# EAGLE design EurocardBackplane-V2_0-short (EAGLE 6.6.0)

## Sheet 1 of 2
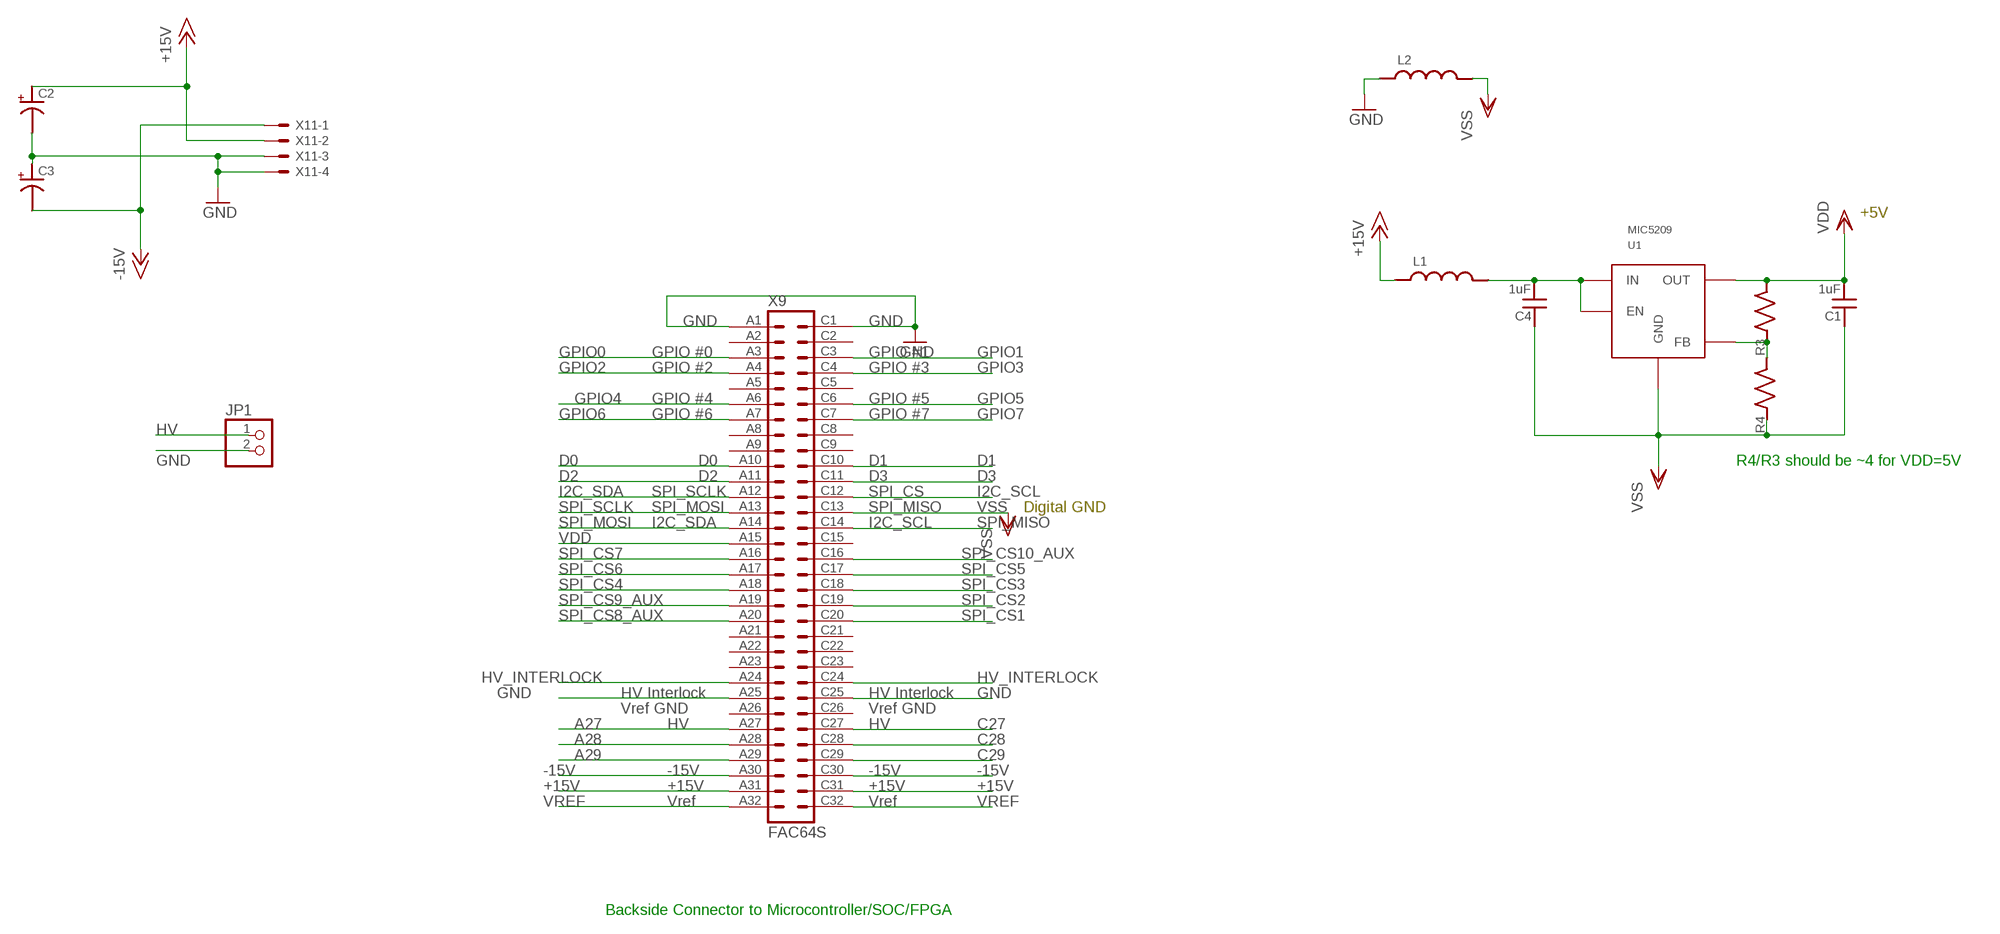
[diagram p0: schematic, sheet 1]

### Parts
C1  1uF  C_MLCC_SMDCMLCC_0603  [C_MLCC_0603]
C2  C_POL_SMDF  [PANASONIC_F]
C3  C_POL_SMDF  [PANASONIC_F]
C4  1uF  C_MLCC_SMDCMLCC_0603  [C_MLCC_0603]
JP1  PINHD-1X2  [1X02]
L1  L_FERRITE_SMDLFERRITE_0805  [R_0805]
L2  L_FERRITE_SMDLFERRITE_0805  [R_0805]
R3  R_SMDR0603  [R_0603]
R4  R_SMDR0603  [R_0603]
U1  MIC5209  [TO263-5]
X9  FAC64S  [FAC64S]
X11  5566-4  [5566-4]

### Nets
+15V: C2.+ L1.P$1 X9.A31 X9.C31 X11.2 ; also sheet 2
-15V: C3.- X9.A30 X9.C30 X11.1 ; also sheet 2
A27: X9.A27 ; also sheet 2
A28: X9.A28 ; also sheet 2
A29: X9.A29 ; also sheet 2
C27: X9.C27 ; also sheet 2
C28: X9.C28 ; also sheet 2
C29: X9.C29 ; also sheet 2
D0: X9.A10 ; also sheet 2
D1: X9.C10 ; also sheet 2
D2: X9.A11 ; also sheet 2
D3: X9.C11 ; also sheet 2
GND: C2.- C3.+ JP1.2 L2.P$1 X9.A1 X9.A25 X9.C1 X9.C25 X11.3 X11.4 ; also sheet 2
GPIO0: X9.A3 ; also sheet 2
GPIO1: X9.C3 ; also sheet 2
GPIO2: X9.A4 ; also sheet 2
GPIO3: X9.C4 ; also sheet 2
GPIO4: X9.A6 ; also sheet 2
GPIO5: X9.C6 ; also sheet 2
GPIO6: X9.A7 ; also sheet 2
GPIO7: X9.C7 ; also sheet 2
HV: JP1.1 ; also sheet 2
HV_INTERLOCK: X9.A24 X9.C24 ; also sheet 2
I2C_SCL: X9.C12 ; also sheet 2
I2C_SDA: X9.A12 ; also sheet 2
N$1: C4.P$2 L1.P$2 U1.1(EN) U1.2(IN)
N$5: R3.P$1 R4.P$2 U1.5(FB)
SPI_CS1: X9.C20
SPI_CS2: X9.C19
SPI_CS3: X9.C18
SPI_CS4: X9.A18
SPI_CS5: X9.C17
SPI_CS6: X9.A17 ; also sheet 2
SPI_CS7: X9.A16 ; also sheet 2
SPI_CS8_AUX: X9.A20
SPI_CS9_AUX: X9.A19
SPI_CS10_AUX: X9.C16 ; also sheet 2
SPI_MISO: X9.C14 ; also sheet 2
SPI_MOSI: X9.A14 ; also sheet 2
SPI_SCLK: X9.A13 ; also sheet 2
VDD: C1.P$2 R3.P$2 U1.4(OUT) X9.A15 ; also sheet 2
VREF: X9.A32 X9.C32 ; also sheet 2
VSS: C1.P$1 C4.P$1 L2.P$2 R4.P$1 U1.3(GND) U1.6(GND) X9.C13 ; also sheet 2
Unconnected: X9.A2 X9.A5 X9.A8 X9.A9 X9.A21 X9.A22 X9.A23 X9.A26 X9.C2 X9.C5 X9.C8 X9.C9 X9.C15 X9.C21 X9.C22 X9.C23 X9.C26

### Notes on the sheet
- +5V
- R4/R3 should be ~4 for VDD=5V
- Digital GND
- Backside Connector to Microcontroller/SOC/FPGA

## Sheet 2 of 2
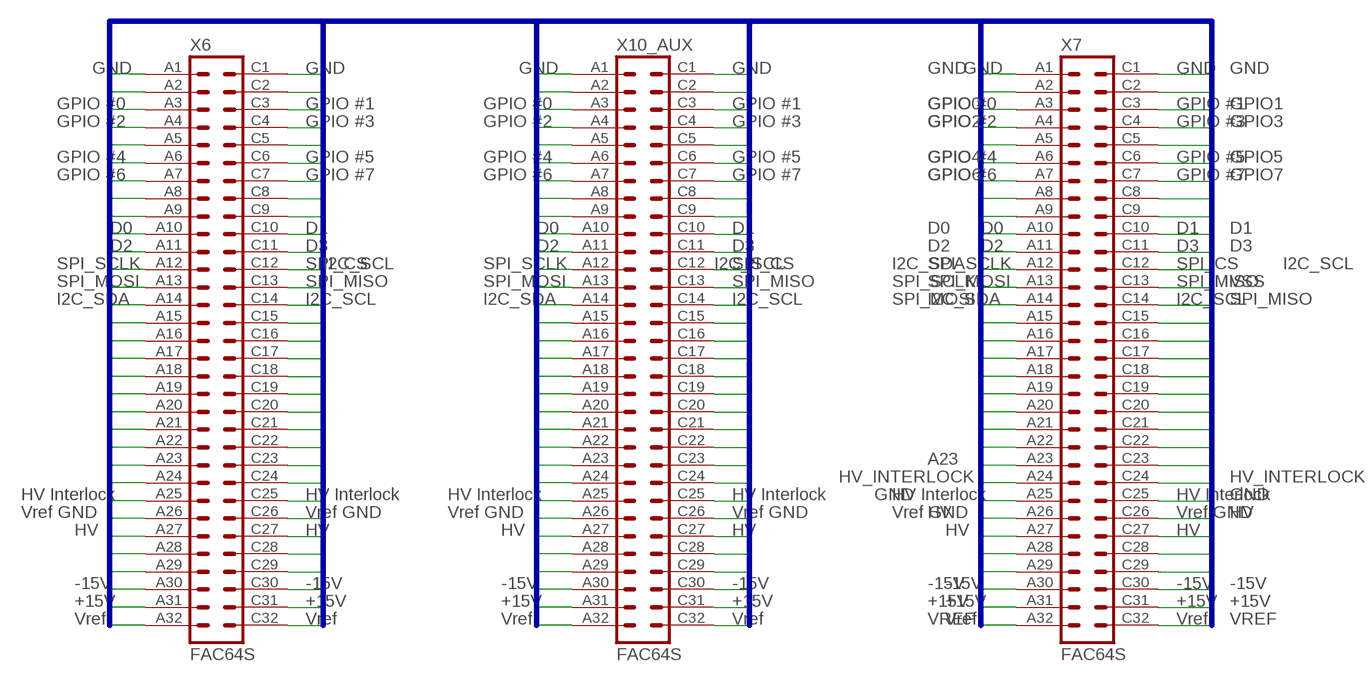
[diagram p1: schematic, sheet 2]

### Parts
X6  FAC64S  [FAC64S]
X7  FAC64S  [FAC64S]
X10_AUX  FAC64S  [FAC64S]

### Nets
+15V: X6.A31 X6.C31 X7.A31 X7.C31 X10_AUX.A31 X10_AUX.C31 ; also sheet 1
-15V: X6.A30 X6.C30 X7.A30 X7.C30 X10_AUX.A30 X10_AUX.C30 ; also sheet 1
A2: X6.A2 X7.A2 X10_AUX.A2
A5: X6.A5 X7.A5 X10_AUX.A5
A8: X6.A8 X7.A8 X10_AUX.A8
A9: X6.A9 X7.A9 X10_AUX.A9
A16: X6.A16 X7.A16 X10_AUX.A16
A17: X6.A17 X7.A17 X10_AUX.A17
A18: X6.A18 X7.A18 X10_AUX.A18
A19: X6.A19 X7.A19 X10_AUX.A19
A20: X6.A20 X7.A20 X10_AUX.A20
A21: X6.A21 X7.A21 X10_AUX.A21
A22: X6.A22 X7.A22 X10_AUX.A22
A23: X6.A23 X7.A23 X10_AUX.A23
A27: X6.A27 X7.A27 X10_AUX.A27 ; also sheet 1
A28: X6.A28 X7.A28 X10_AUX.A28 ; also sheet 1
A29: X6.A29 X7.A29 X10_AUX.A29 ; also sheet 1
C2: X6.C2 X7.C2 X10_AUX.C2
C5: X6.C5 X7.C5 X10_AUX.C5
C8: X6.C8 X7.C8 X10_AUX.C8
C9: X6.C9 X7.C9 X10_AUX.C9
C16: X6.C16 X7.C16 X10_AUX.C16
C17: X6.C17 X7.C17 X10_AUX.C17
C18: X6.C18 X7.C18 X10_AUX.C18
C19: X6.C19 X7.C19 X10_AUX.C19
C20: X6.C20 X7.C20 X10_AUX.C20
C21: X6.C21 X7.C21 X10_AUX.C21
C22: X6.C22 X7.C22 X10_AUX.C22
C23: X6.C23 X7.C23 X10_AUX.C23
C27: X6.C27 X7.C27 X10_AUX.C27 ; also sheet 1
C28: X6.C28 X7.C28 X10_AUX.C28 ; also sheet 1
C29: X6.C29 X7.C29 X10_AUX.C29 ; also sheet 1
D0: X6.A10 X7.A10 X10_AUX.A10 ; also sheet 1
D1: X6.C10 X7.C10 X10_AUX.C10 ; also sheet 1
D2: X6.A11 X7.A11 X10_AUX.A11 ; also sheet 1
D3: X6.C11 X7.C11 X10_AUX.C11 ; also sheet 1
GND: X6.A1 X6.A25 X6.C1 X6.C25 X7.A1 X7.A25 X7.C1 X7.C25 X10_AUX.A1 X10_AUX.A25 X10_AUX.C1 X10_AUX.C25 ; also sheet 1
GPIO0: X6.A3 X7.A3 X10_AUX.A3 ; also sheet 1
GPIO1: X6.C3 X7.C3 X10_AUX.C3 ; also sheet 1
GPIO2: X6.A4 X7.A4 X10_AUX.A4 ; also sheet 1
GPIO3: X6.C4 X7.C4 X10_AUX.C4 ; also sheet 1
GPIO4: X6.A6 X7.A6 X10_AUX.A6 ; also sheet 1
GPIO5: X6.C6 X7.C6 X10_AUX.C6 ; also sheet 1
GPIO6: X6.A7 X7.A7 X10_AUX.A7 ; also sheet 1
GPIO7: X6.C7 X7.C7 X10_AUX.C7 ; also sheet 1
HV: X6.A26 X6.C26 X7.A26 X7.C26 X10_AUX.A26 X10_AUX.C26 ; also sheet 1
HV_INTERLOCK: X6.A24 X6.C24 X7.A24 X7.C24 X10_AUX.A24 X10_AUX.C24 ; also sheet 1
I2C_SCL: X6.C12 X7.C12 X10_AUX.C12 ; also sheet 1
I2C_SDA: X6.A12 X7.A12 X10_AUX.A12 ; also sheet 1
SPI_CS6: X6.C15 ; also sheet 1
SPI_CS7: X7.C15 ; also sheet 1
SPI_CS10_AUX: X10_AUX.C15 ; also sheet 1
SPI_MISO: X6.C14 X7.C14 X10_AUX.C14 ; also sheet 1
SPI_MOSI: X6.A14 X7.A14 X10_AUX.A14 ; also sheet 1
SPI_SCLK: X6.A13 X7.A13 X10_AUX.A13 ; also sheet 1
VDD: X6.A15 X7.A15 X10_AUX.A15 ; also sheet 1
VREF: X6.A32 X6.C32 X7.A32 X7.C32 X10_AUX.A32 X10_AUX.C32 ; also sheet 1
VSS: X6.C13 X7.C13 X10_AUX.C13 ; also sheet 1

### Buses
A[1..32],C[1..32]

## Library data of the parts
C1 C4 = jqi_passives:C_MLCC_SMD
C2 C3 = jqi_passives:C_POL_SMD
JP1 = pinhead:PINHD-1X2: PIN HEADER
L1 L2 = jqi_passives:L_FERRITE_SMD
R3 R4 = jqi_passives:R_SMD
U1 = regulator-jqi:MIC5209: MIC5209YU Adjustable regulator, 500mA. Vout = 1.242(1+R2/R1), R2 less than 470k (top of divider partition).
X6 X7 X9 X10_AUX = Eurocard-Backplane-jqi:FAC64S: CONNECTOR female, 64 pins, block, type C, rows AC, grid 5.08 mm
X11 = Eurocard-Backplane-jqi:5566-4: Mini FIT connector 4 pol Source: http://www.molex.com; OC_FARNELL: unknown; OC_NEWARK: unknown

## Board
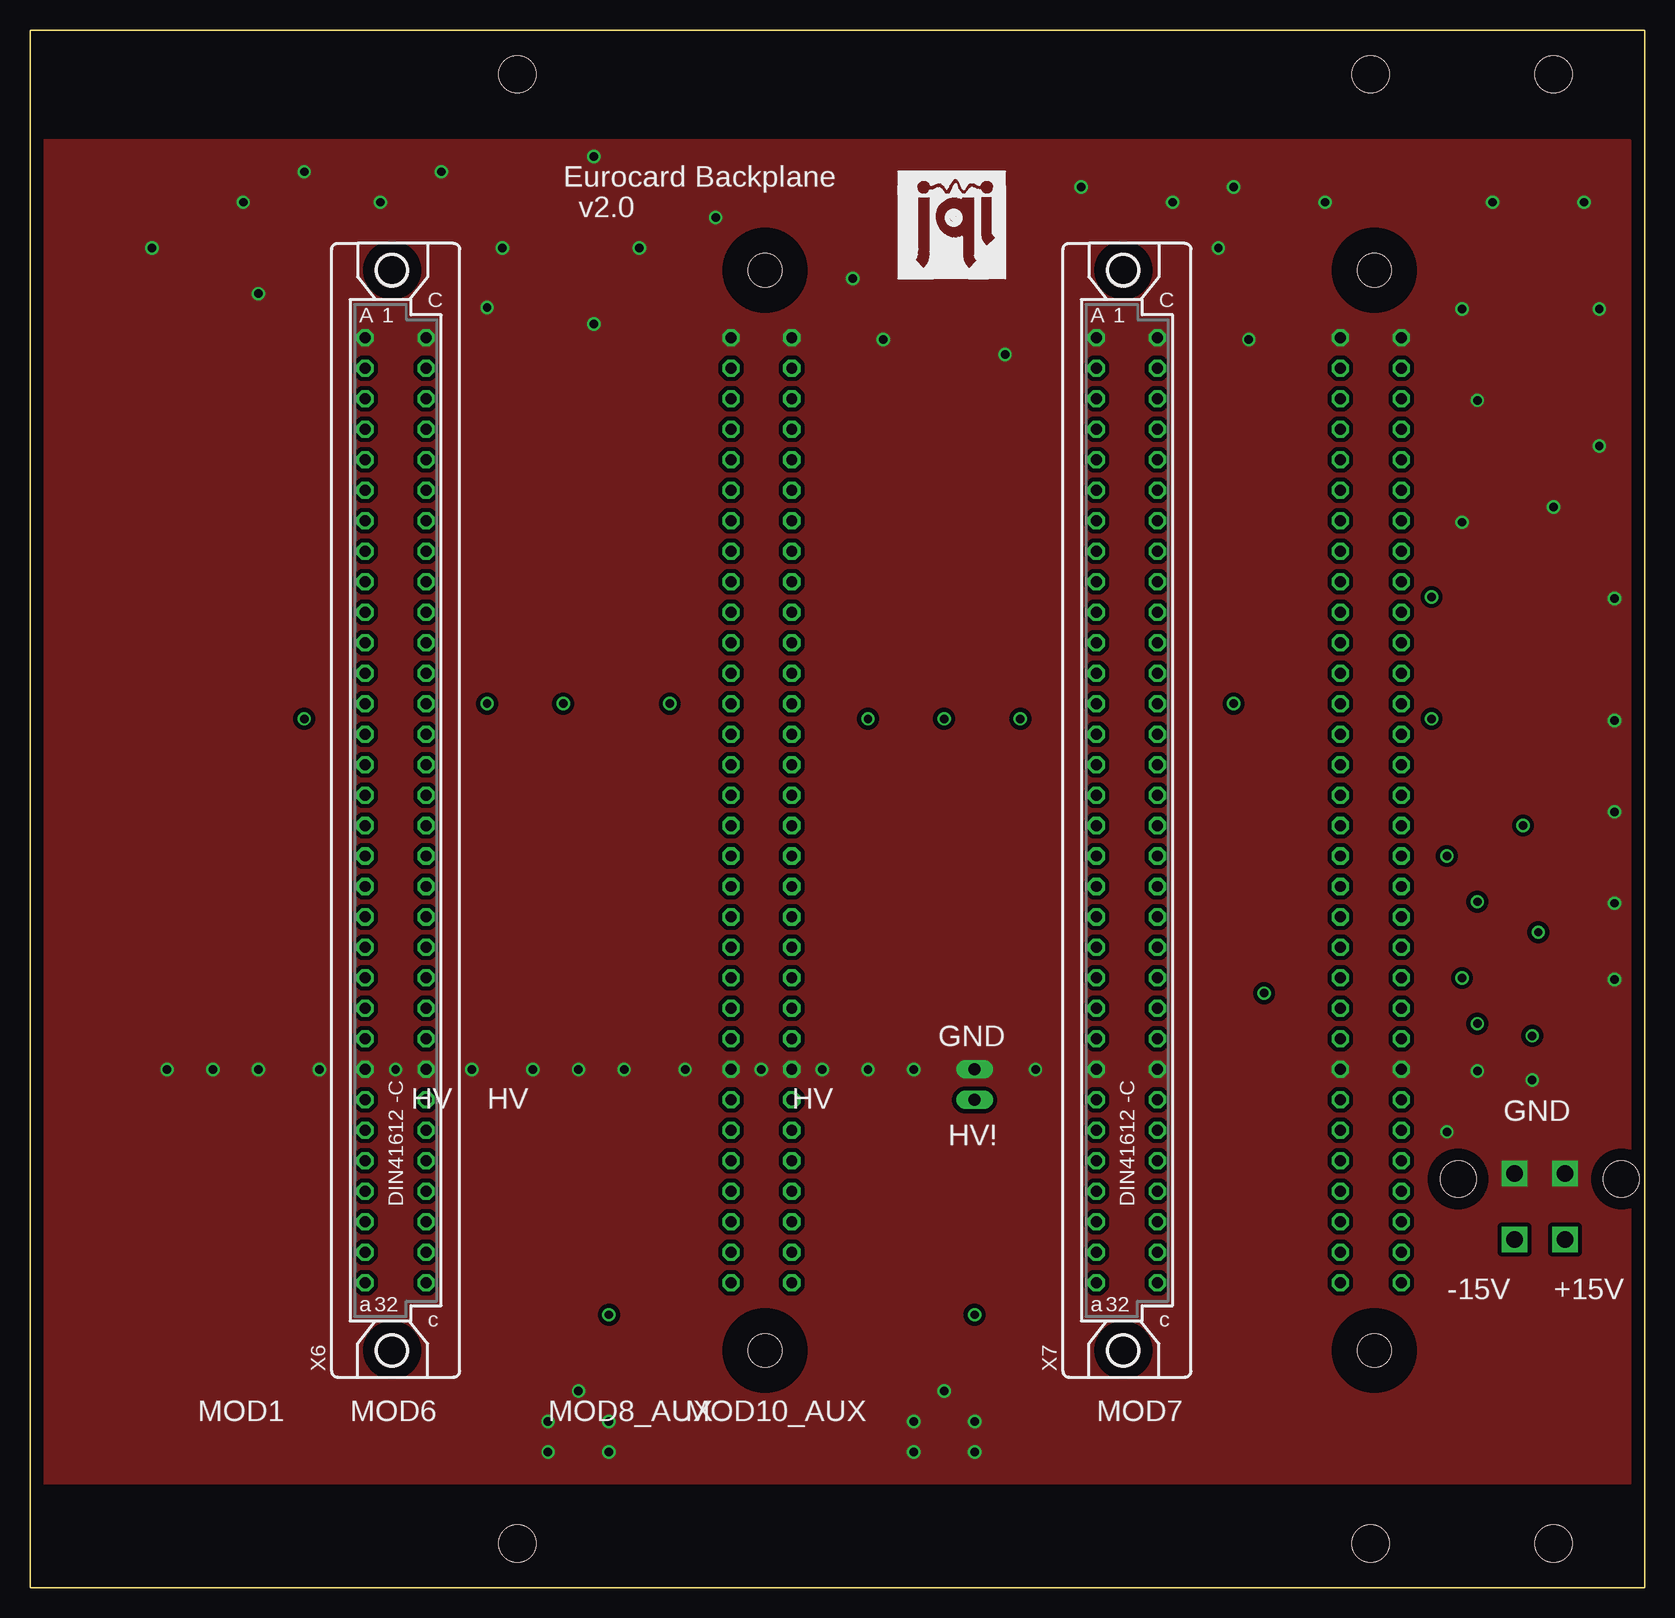
[diagram p2: board, top side]
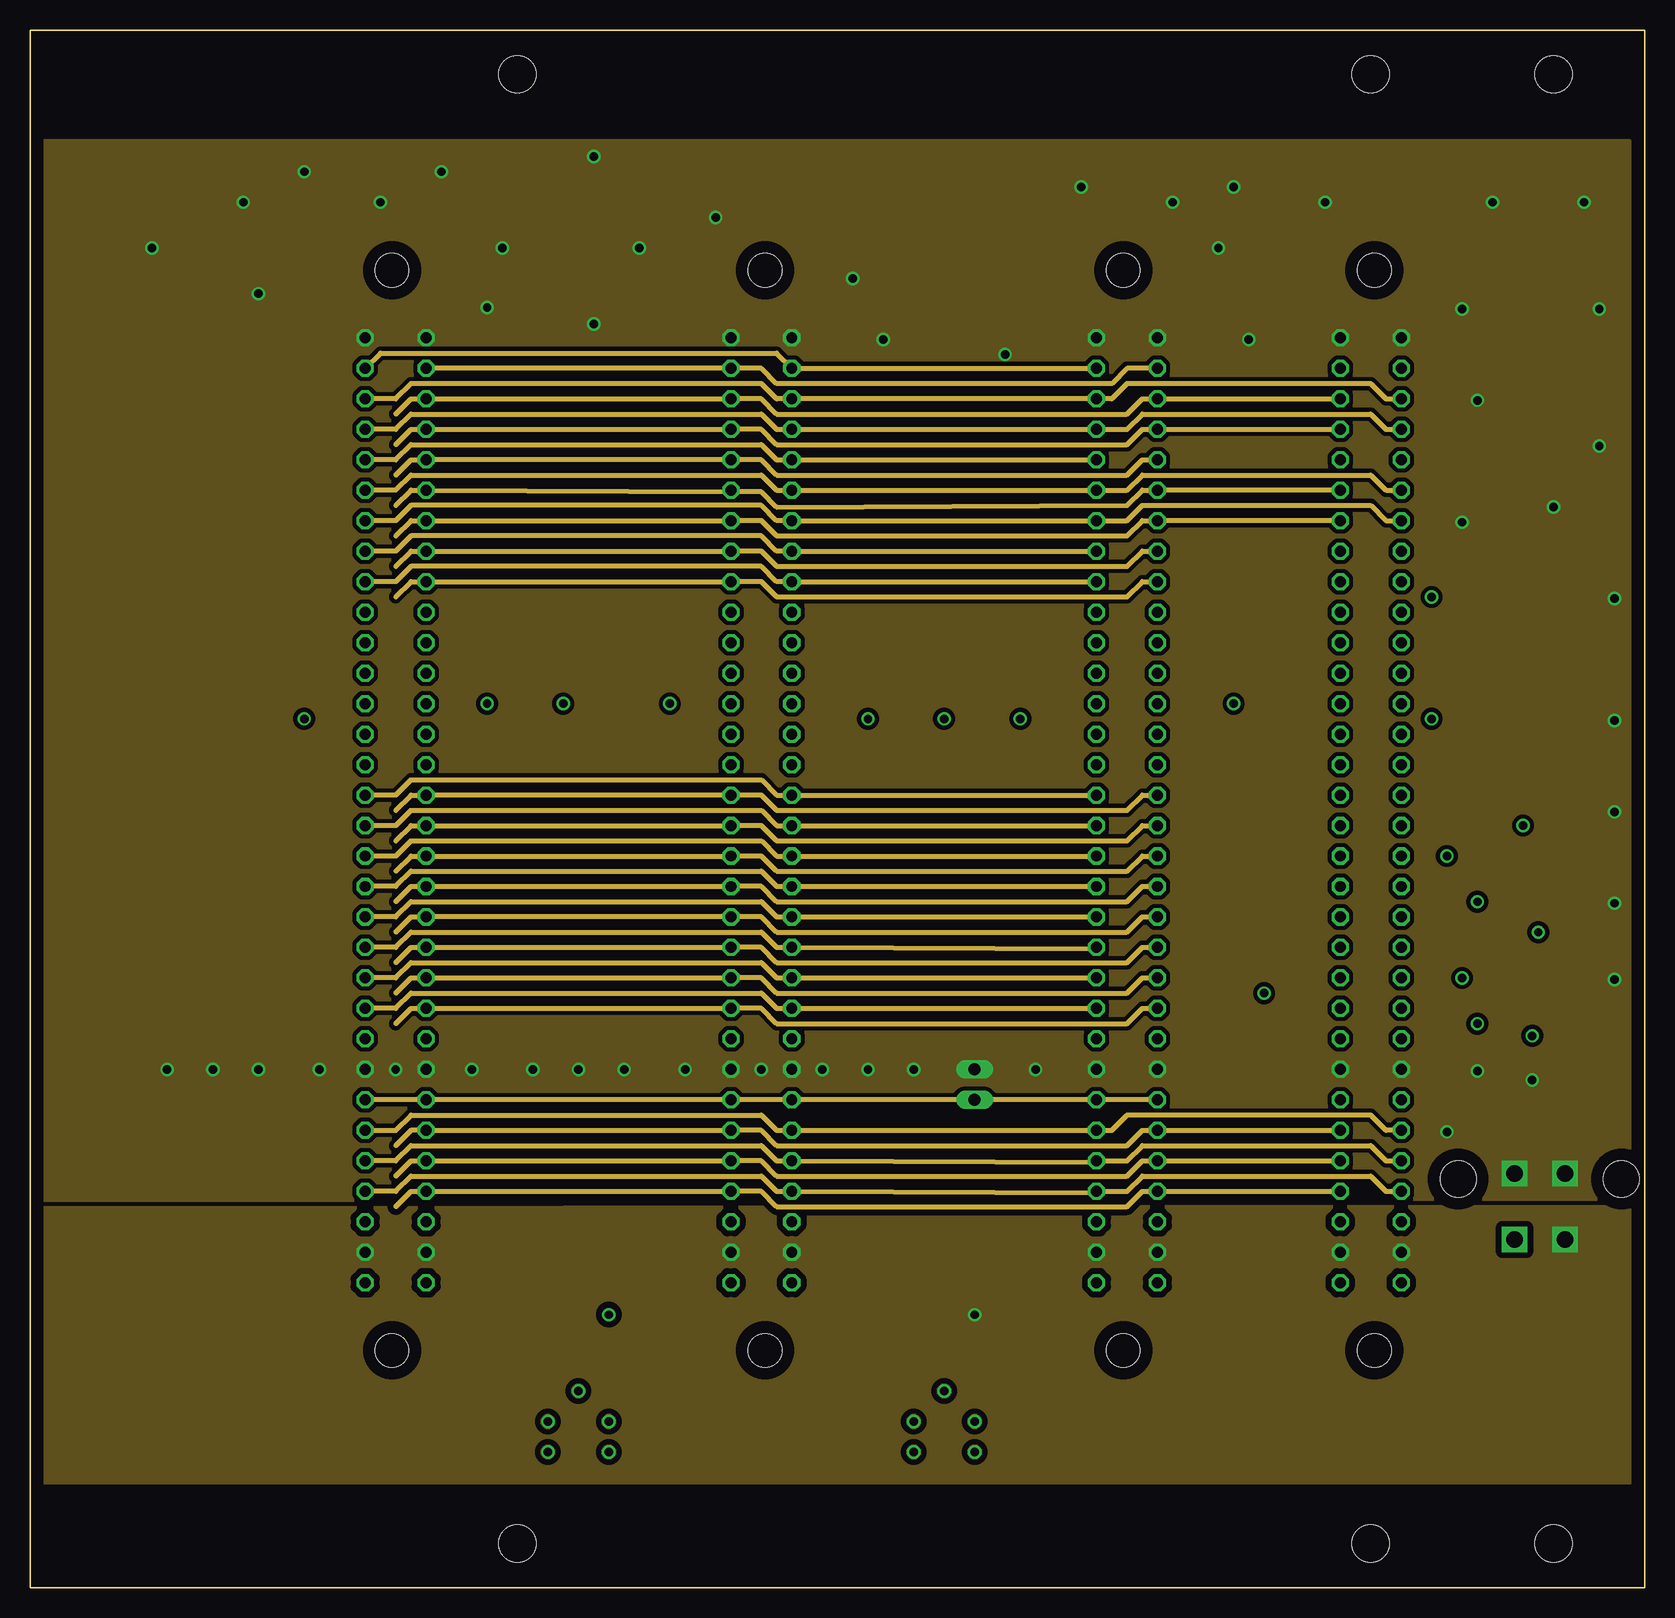
[diagram p3: board, inner layer Route2]
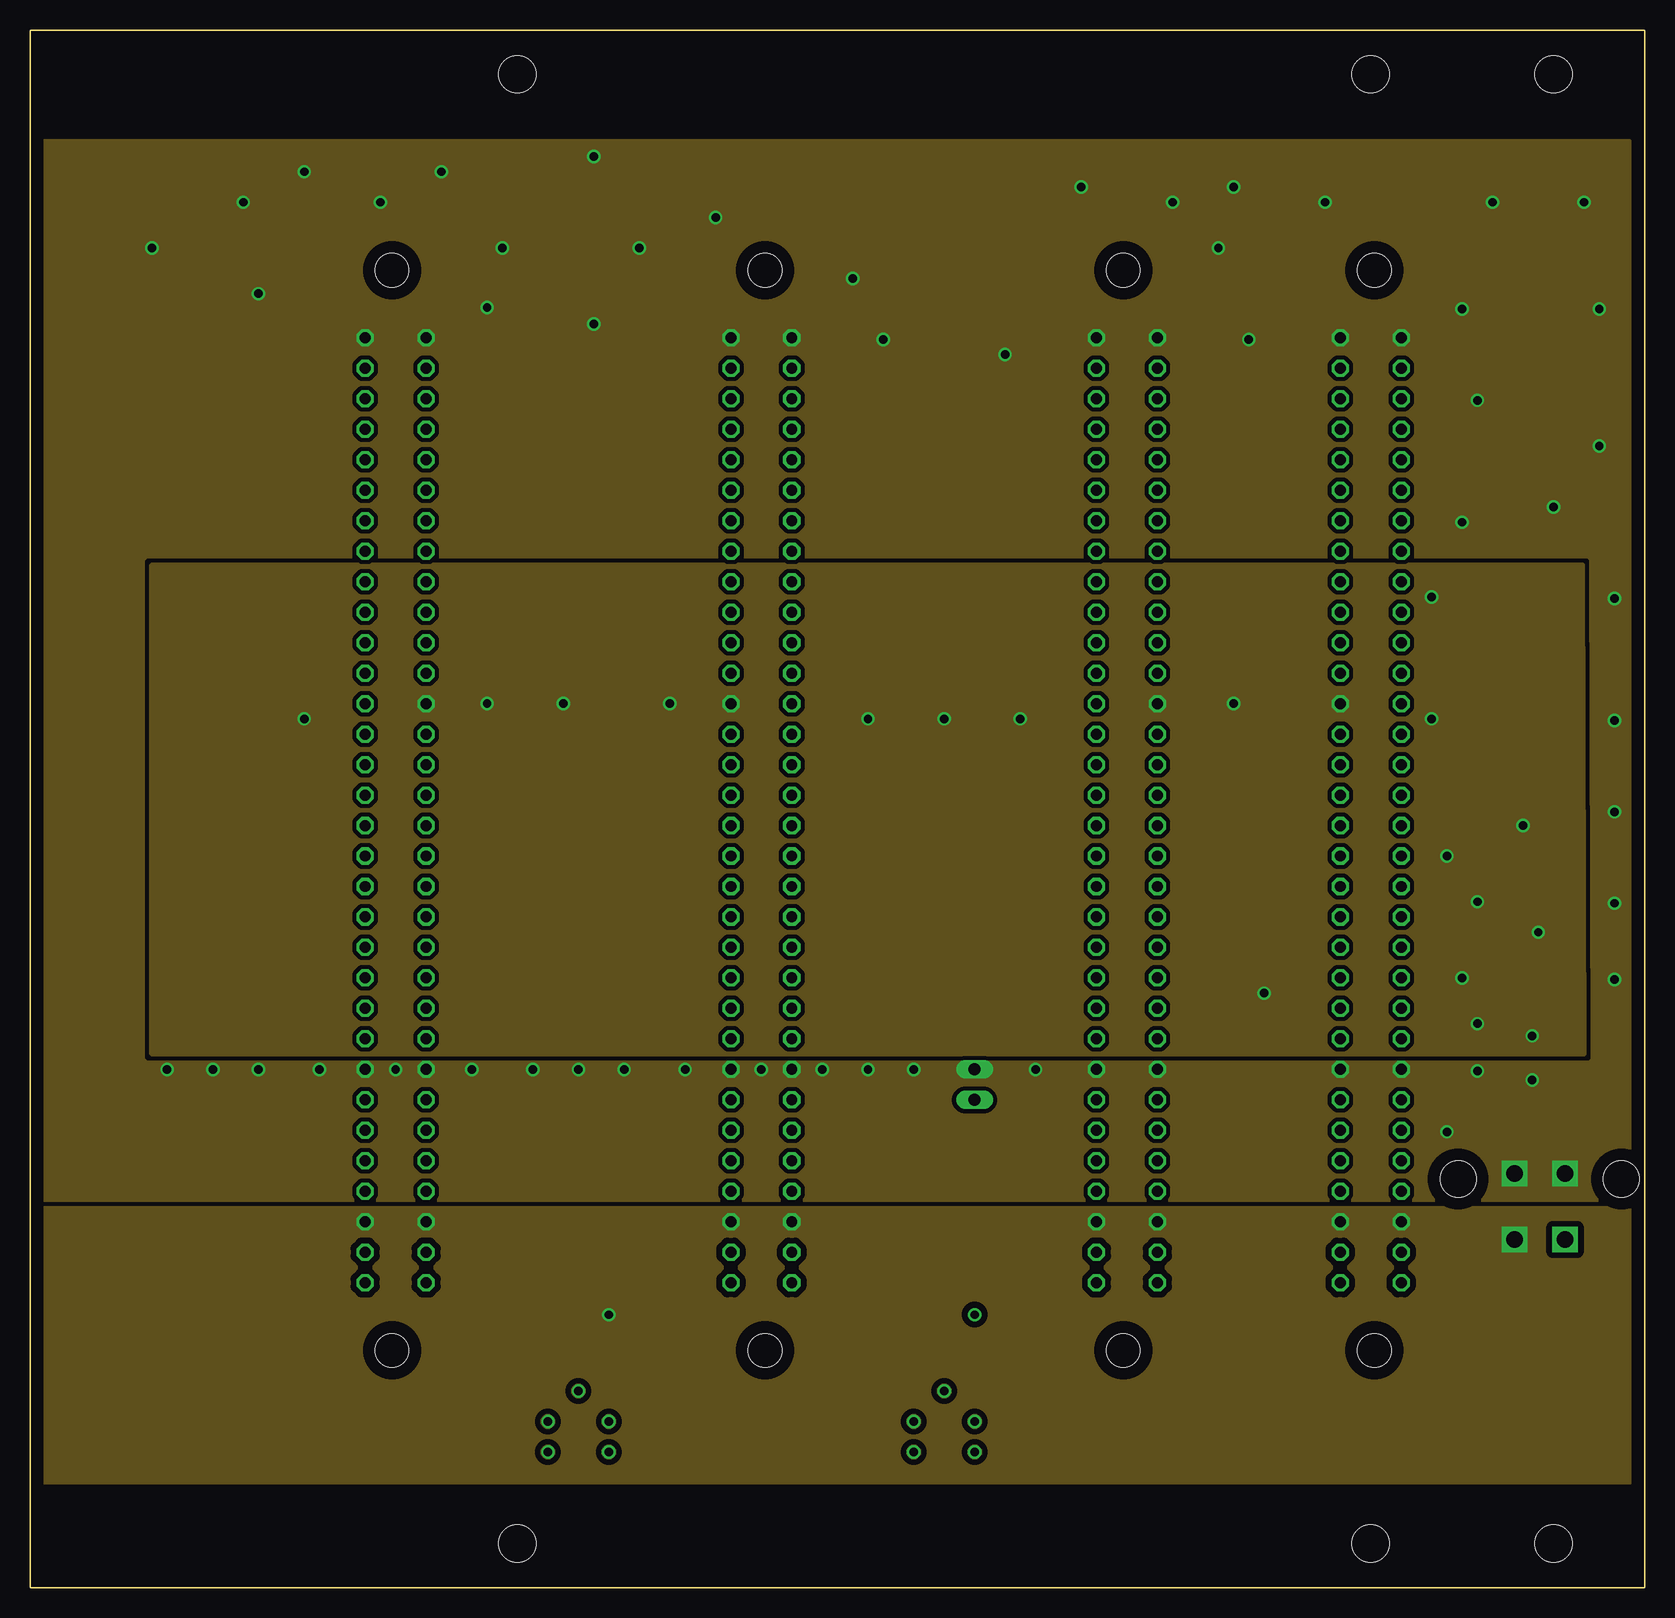
[diagram p4: board, inner layer Route15]
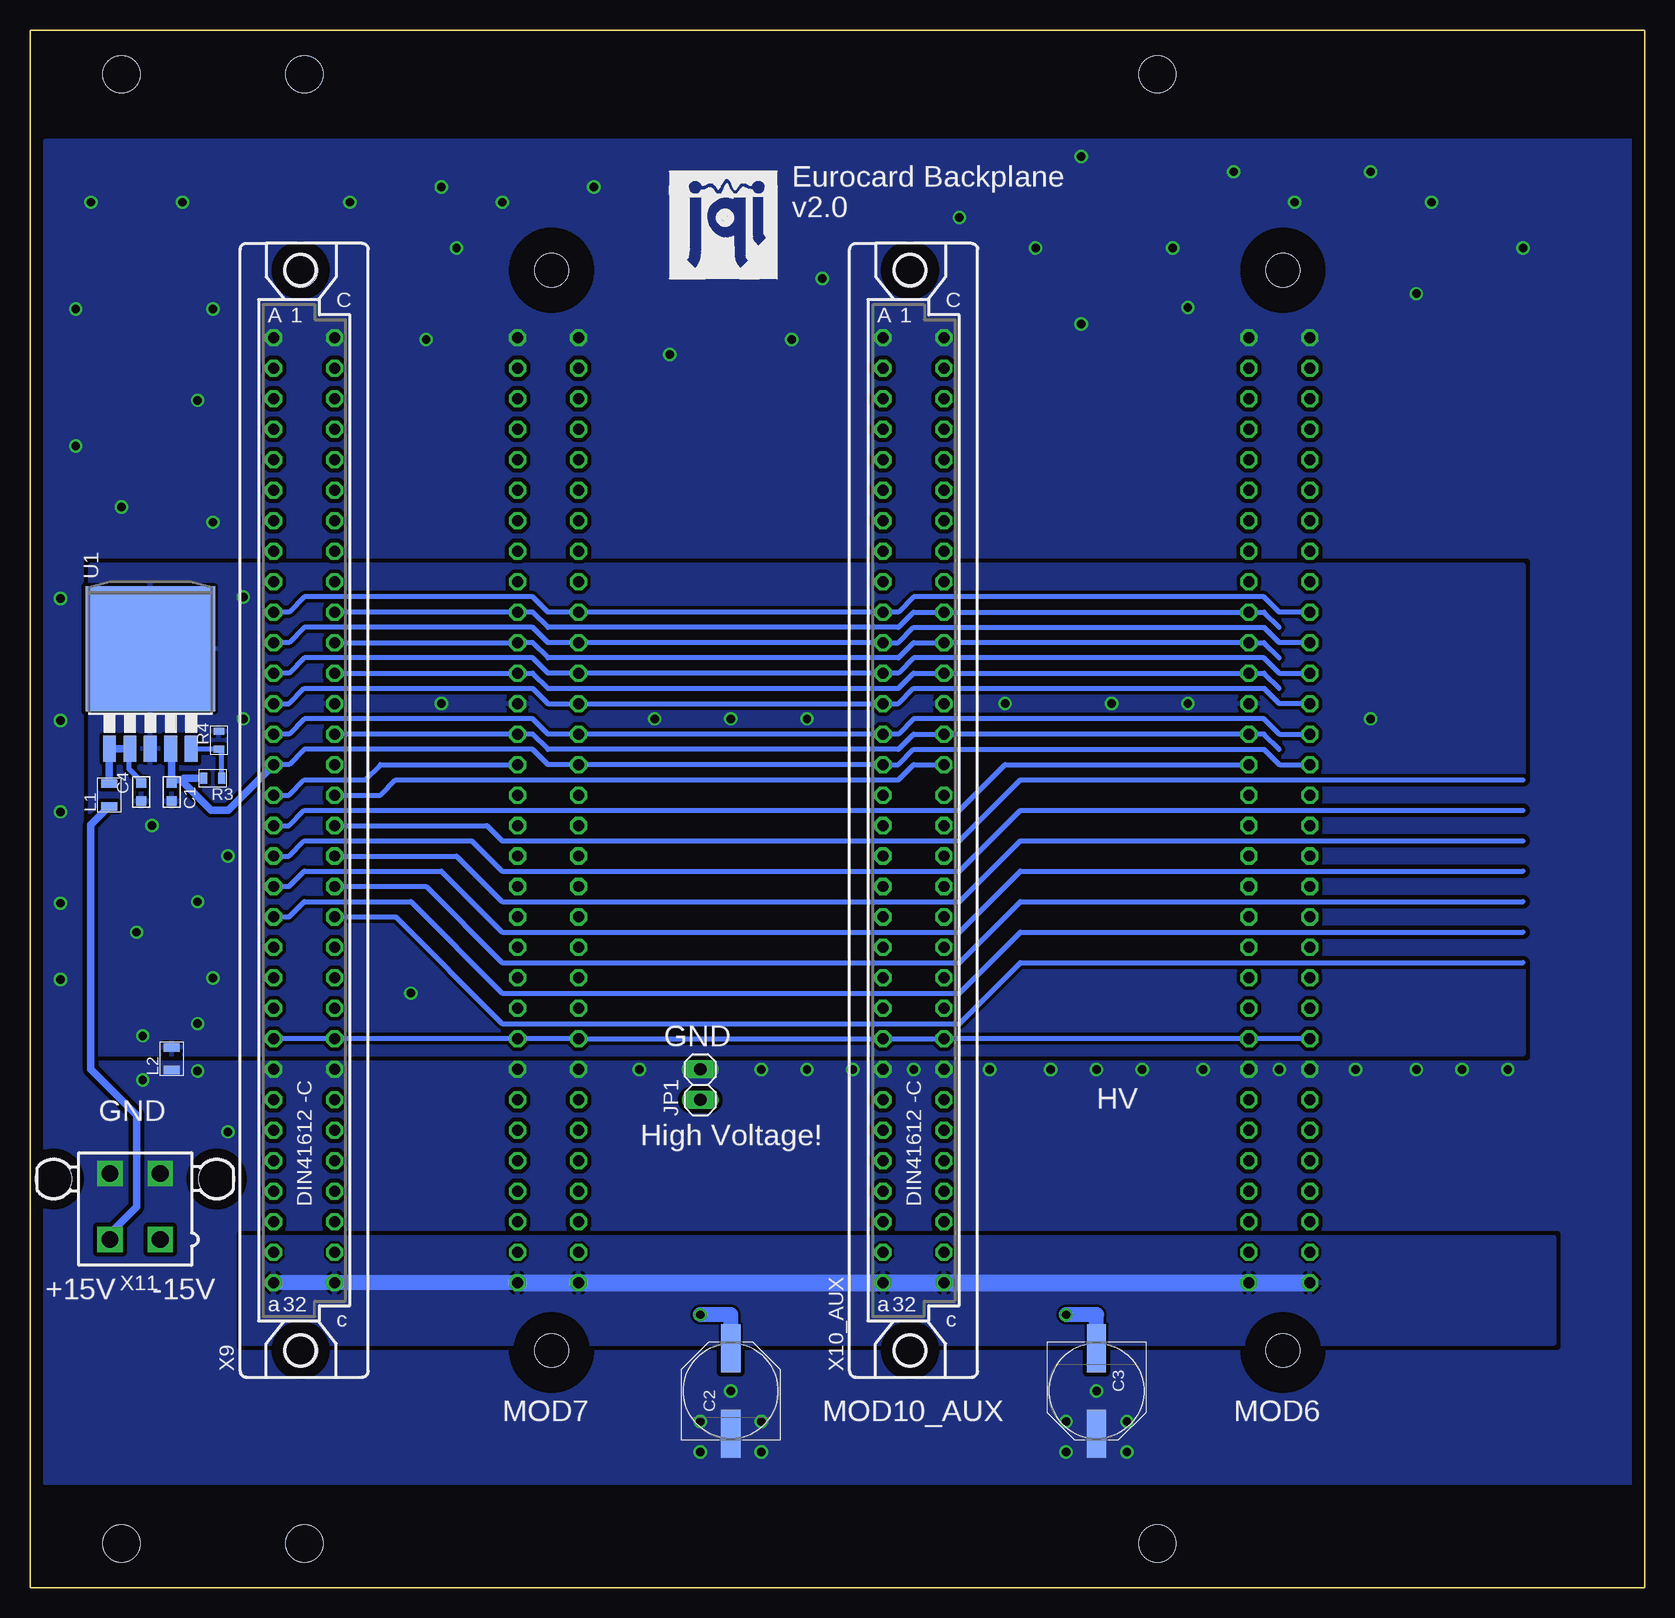
[diagram p5: board, bottom side, seen from below]

Size 134.62 x 129.79 mm. Coordinates in mm from the lower left corner, seen from the top.
Copper layers (1+2*15+16): Top 0.035mm / dielectric 1.5mm / Route2 0.035mm / dielectric 0.15mm / Route15 0.035mm / dielectric 0.2mm / Bottom 0.035mm
Design rules "default": minimum track width 10mil, minimum drill 24mil, track to track 8mil, track to pad 8mil, pad to pad 8mil, via to via 8mil, smd to smd 8mil, copper to edge 40mil, drill to drill 8mil, minimum pad ring 10mil, minimum via ring 8mil, stop-mask expansion 4mil, vias tented up to drill 0mil, thermal gap 10mil

### Footprints (pad centres in the part's own frame; a part is rotated, then mirrored left to right if it is on the bottom)
C_MLCC_0603 = smd 0.8 x 0.8: P$1 -0.75,0; P$2 0.75,0
PANASONIC_F = smd 4 x 1.6: + 3.55,0; - -3.55,0
1X02 = drill 1.016 long: 1 -1.27,0; 2 1.27,0
R_0805 = smd 0.7 x 1.3: P$1 -0.95,0; P$2 0.95,0
R_0603 = smd 0.6 x 0.9: P$1 -0.75,0; P$2 0.75,0
TO263-5 = smd 1.067 x 2.159: 1 -3.404,-5.791; 2 -1.702,-5.791; 3 0,-5.791; 4 1.702,-5.791; 5 3.404,-5.791 | smd 10.8 x 10.41: 6 0,2.54
BACKPLN-PROTO = hole 3.099: 40.64,126.111; 127,126.111; 127,3.683; 40.64,3.683; 111.76,3.683; 111.76,126.111
FAC64S = drill 0.914 octagon: A1 -2.54,39.37; A2 -2.54,36.83; A3 -2.54,34.29; A4 -2.54,31.75; A5 -2.54,29.21; A6 -2.54,26.67; A7 -2.54,24.13; A8 -2.54,21.59; A9 -2.54,19.05; A10 -2.54,16.51; A11 -2.54,13.97; A12 -2.54,11.43; A13 -2.54,8.89; A14 -2.54,6.35; A15 -2.54,3.81; A16 -2.54,1.27; A17 -2.54,-1.27; A18 -2.54,-3.81; A19 -2.54,-6.35; A20 -2.54,-8.89; A21 -2.54,-11.43; A22 -2.54,-13.97; A23 -2.54,-16.51; A24 -2.54,-19.05; A25 -2.54,-21.59; A26 -2.54,-24.13; A27 -2.54,-26.67; A28 -2.54,-29.21; A29 -2.54,-31.75; A30 -2.54,-34.29; A31 -2.54,-36.83; A32 -2.54,-39.37; C1 2.54,39.37; C2 2.54,36.83; C3 2.54,34.29; C4 2.54,31.75; C5 2.54,29.21; C6 2.54,26.67; C7 2.54,24.13; C8 2.54,21.59; C9 2.54,19.05; C10 2.54,16.51; C11 2.54,13.97; C12 2.54,11.43; C13 2.54,8.89; C14 2.54,6.35; C15 2.54,3.81; C16 2.54,1.27; C17 2.54,-1.27; C18 2.54,-3.81; C19 2.54,-6.35; C20 2.54,-8.89; C21 2.54,-11.43; C22 2.54,-13.97; C23 2.54,-16.51; C24 2.54,-19.05; C25 2.54,-21.59; C26 2.54,-24.13; C27 2.54,-26.67; C28 2.54,-29.21; C29 2.54,-31.75; C30 2.54,-34.29; C31 2.54,-36.83; C32 2.54,-39.37 | hole 2.794: -0.305,45.009; -0.305,-45.009
5566-4 = drill 1.4 square: 1 2.1,-2.75; 2 -2.1,-2.75; 3 2.1,2.75; 4 -2.1,2.75 | hole 3: 6.8,2.29; -6.8,2.29

### Placement (x,y rotation side)
C1  122.81,66.29 90 bottom
C2  76.2,16.38 90 bottom
C3  45.72,16.38 270 bottom
C4  125.35,66.29 90 bottom
JP1  78.74,41.91 90 bottom
L1  128.02,66.04 90 bottom
L2  122.81,44.07 90 bottom
R3  119.38,67.44 180 bottom
R4  118.87,70.61 270 bottom
U1  124.59,75.69 0 bottom
U$1  [JQI_LOGO_NEGATIVE-SILKSCREEN]  72.39,109.09 0 top
U$2  [BACKPLN-PROTO]  0,0 0 top
U$4  [JQI_LOGO_NEGATIVE-SILKSCREEN]  81.28,109.09 0 bottom
X6  30.48,64.77 0 top
X7  91.44,64.77 0 top
X9  111.76,64.77 0 bottom
X10_AUX  60.96,64.77 0 bottom
X11  125.86,31.75 0 bottom

### Tracks (layer width: path | path; a pad name or v marks a point on that pad's centre or on a via)
+15V  (via drill 0.7)
  Bottom 0.406: X11.2 127.96,29.66 127.82,29.66
  Bottom 0.61: 127.82,29.66 125.73,31.75 125.73,39.37 129.54,43.18 129.54,63.57 L1.P$1
  Bottom 1.27: C2.+ 76.2,22.73 v78.74,22.73
  pour Route2 (isolate 0.508, no thermals): 133.35,8.76 0,8.76 0,31.62 133.35,31.75
-15V  (via drill 0.7)
  Bottom 1.27: C3.- 45.72,22.73 v48.26,22.73
  pour Route15 (isolate 0.508, no thermals): 133.35,31.62 133.35,8.76 0,8.76 0,31.62
A2
  Route2 0.406: 88.77,101.47 X7.A2 X10_AUX.A2 62.23,102.87 29.21,102.87 X6.A2
A5
  Route2 0.406: X6.A5 30.48,93.98 31.75,95.25 60.96,95.25 62.23,93.98 X10_AUX.A5 X7.A5
A8
  Route2 0.406: X6.A8 30.48,86.36 31.75,87.63 60.96,87.63 62.23,86.36 X10_AUX.A8 X7.A8
A9
  Route2 0.406: X6.A9 30.48,83.82 31.75,85.09 60.96,85.09 62.23,83.82 X10_AUX.A9 X7.A9
A16
  Route2 0.406: X6.A16 30.48,66.04 31.75,67.31 60.96,67.31 62.23,66.04 X10_AUX.A16 X7.A16
A17
  Route2 0.406: X6.A17 30.48,63.5 31.75,64.77 60.96,64.77 62.23,63.5 X10_AUX.A17 X7.A17
A18
  Route2 0.406: X6.A18 30.48,60.96 31.75,62.23 60.96,62.23 62.23,60.96 X10_AUX.A18 X7.A18
A19
  Route2 0.406: X6.A19 30.48,58.42 31.75,59.69 60.96,59.69 62.23,58.42 X10_AUX.A19 X7.A19
A20
  Route2 0.406: X6.A20 30.48,55.88 31.75,57.15 60.96,57.15 62.23,55.88 X10_AUX.A20 X7.A20
A21
  Route2 0.406: X6.A21 30.48,53.34 31.75,54.61 60.96,54.61 62.23,53.34 X10_AUX.A21 88.9,53.21 X7.A21
A22
  Route2 0.406: X6.A22 30.48,50.8 31.75,52.07 60.96,52.07 62.23,50.8 X10_AUX.A22 X7.A22
A23
  Route2 0.406: X6.A23 30.48,48.26 31.75,49.53 60.96,49.53 62.23,48.26 X10_AUX.A23 X7.A23
A27
  Route2 0.406: X6.A27 30.48,38.1 31.75,39.37 60.96,39.37 62.23,38.1 X10_AUX.A27 X7.A27 90.17,38.1 91.44,39.37 111.76,39.37 113.03,38.1 X9.A27
A28
  Route2 0.406: X6.A28 30.48,35.56 31.75,36.83 60.96,36.83 62.23,35.56 X10_AUX.A28 88.9,35.43 X7.A28 91.44,35.56 92.71,36.83 111.76,36.83 113.03,35.56 X9.A28
A29
  Route2 0.406: X6.A29 30.48,33.02 31.75,34.29 60.96,34.29 62.23,33.02 X10_AUX.A29 88.9,32.89 X7.A29 91.44,33.02 92.71,34.29 111.76,34.29 113.03,33.02 X9.A29
C2
  Route2 0.406: 93.98,101.47 X7.C2 91.44,101.6 90.17,100.33 62.23,100.33 60.96,101.6 X10_AUX.C2 X6.C2 33.15,101.47
C5
  Route2 0.406: 93.98,93.85 X7.C5 92.71,93.98 91.44,92.71 62.23,92.71 60.96,93.98 X10_AUX.C5 X6.C5 31.75,93.98 30.48,92.71
C8
  Route2 0.406: 30.48,85.09 31.75,86.36 X6.C8 X10_AUX.C8 60.96,86.36 62.23,85.09 91.44,85.09 92.71,86.36 X7.C8
C9
  Route2 0.406: 30.48,82.55 31.75,83.82 X6.C9 X10_AUX.C9 60.96,83.82 62.23,82.55 91.44,82.55 92.71,83.82 X7.C9
C16
  Route2 0.406: 30.48,64.77 31.75,66.04 X6.C16 X10_AUX.C16 | X7.C16 92.71,66.04 91.44,64.77 62.23,64.77 60.96,66.04 X10_AUX.C16 | 58.29,66.04 X10_AUX.C16
C17
  Route2 0.406: 30.48,62.23 31.75,63.5 X6.C17 X10_AUX.C17 60.96,63.5 62.23,62.23 91.44,62.23 92.71,63.5 X7.C17
C18
  Route2 0.406: 30.48,59.69 31.75,60.96 X6.C18 X10_AUX.C18 60.96,60.96 62.23,59.69 91.44,59.69 92.71,60.96 X7.C18
C19
  Route2 0.406: 30.48,57.15 31.75,58.42 X6.C19 X10_AUX.C19 60.96,58.42 62.23,57.15 91.44,57.15 92.71,58.42 X7.C19
C20
  Route2 0.406: 30.48,54.61 31.75,55.88 X6.C20 X10_AUX.C20 60.96,55.88 62.23,54.61 91.44,54.61 92.71,55.88 X7.C20
C21
  Route2 0.406: 30.48,52.07 31.75,53.34 X6.C21 X10_AUX.C21 60.96,53.34 62.23,52.07 91.44,52.07 92.71,53.34 X7.C21
C22
  Route2 0.406: 30.48,49.53 31.75,50.8 X6.C22 X10_AUX.C22 60.96,50.8 62.23,49.53 91.44,49.53 92.71,50.8 X7.C22
C23
  Route2 0.406: 30.48,46.99 31.75,48.26 X6.C23 X10_AUX.C23 60.96,48.26 62.23,46.99 91.44,46.99 92.71,48.26 X7.C23
C27
  Route2 0.406: 30.48,36.83 31.75,38.1 X6.C27 X10_AUX.C27 60.96,38.1 62.23,36.83 91.44,36.83 92.71,38.1 X7.C27 X9.C27
C28
  Route2 0.406: 30.48,34.29 31.75,35.56 X6.C28 X10_AUX.C28 60.96,35.56 62.23,34.29 91.44,34.29 92.71,35.56 X7.C28 X9.C28
C29
  Route2 0.406: 30.48,31.75 31.75,33.02 X6.C29 X10_AUX.C29 60.96,33.02 62.23,31.75 91.44,31.75 92.71,33.02 X7.C29 X9.C29
D0
  Bottom 0.406: X6.A10 30.48,81.28 31.75,82.55 60.96,82.55 62.23,81.28 X10_AUX.A10 X7.A10 91.44,81.28 92.71,82.55 111.76,82.55 113.03,81.28 X9.A10
D1
  Bottom 0.406: 30.48,80.01 31.75,81.28 X6.C10 X10_AUX.C10 60.96,81.28 62.23,80.01 91.44,80.01 92.71,81.28 X7.C10 X9.C10
D2
  Bottom 0.406: X6.A11 30.48,78.74 31.75,80.01 60.96,80.01 62.23,78.74 X10_AUX.A11 X7.A11 91.44,78.74 92.71,80.01 111.76,80.01 113.03,78.74 X9.A11
D3
  Bottom 0.406: 30.48,77.47 31.75,78.74 X6.C11 X10_AUX.C11 60.96,78.74 62.23,77.47 91.44,77.47 92.71,78.74 X7.C11 X9.C11
GND  (via drill 0.7)
  Route15 0.406: 88.9,104.01 X7.A1
  other vias: 17.78,115.44 29.21,115.44 19.05,107.82 57.15,114.17 39.37,111.63 46.99,105.28 46.99,119.25 50.8,111.63 71.12,104.01 81.28,102.74 87.63,116.71 95.25,115.44 99.06,111.63 100.33,116.71 68.58,109.09 38.1,106.68 22.86,117.98 119.38,106.55 78.74,11.3 78.74,13.84 73.66,13.84 73.66,11.3 48.26,11.3 48.26,13.84 43.18,13.84 43.18,11.3 45.72,16.38 76.2,16.38 10.16,111.63 34.29,117.98 83.82,43.18 73.66,43.18 69.85,43.18 66.04,43.18 60.96,43.18 54.61,43.18 49.53,43.18 45.72,43.18 41.91,43.18 36.83,43.18 30.48,43.18 24.13,43.18 15.24,43.18 19.05,43.18 11.43,43.18 125.22,42.29 120.65,43.05 118.11,37.97 132.08,50.67 132.08,57.02 132.08,64.64 132.08,72.26 132.08,82.42 119.38,88.77 127,90.04 130.81,95.12 130.81,106.55 121.92,115.44 129.54,115.44 107.95,115.44 101.6,104.01 120.65,98.93
  pour Top (isolate 0.356, rank 2, no thermals): 0,120.52 133.35,120.52 133.35,8.76 0,8.76
  pour Route2 (isolate 0.356, rank 2, no thermals): 0,120.52 133.35,120.52 133.35,8.76 0,8.76
  pour Route15 (isolate 0.356, rank 2, no thermals): 0,120.52 133.35,120.52 133.35,8.76 0,8.76
  pour Bottom (isolate 0.356, rank 2, no thermals): 0,120.52 133.35,120.52 133.35,8.76 0,8.76
GPIO0
  Route2 0.406: 88.9,98.93 X7.A3 | X7.A3 X10_AUX.A3 62.23,99.06 60.96,100.33 31.75,100.33 30.48,99.06 X6.A3 | X7.A3 90.17,99.06 91.44,100.33 111.76,100.33 113.03,99.06 X9.A3
GPIO1
  Route2 0.406: 93.98,98.93 X7.C3 | 30.48,97.79 31.75,99.06 X6.C3 X10_AUX.C3 60.96,99.06 62.23,97.79 91.44,97.79 92.71,99.06 X7.C3 | X7.C3 X9.C3
GPIO2
  Route2 0.406: X6.A4 30.48,96.52 31.75,97.79 60.96,97.79 62.23,96.52 X10_AUX.A4 X7.A4 91.44,96.52 92.71,97.79 111.76,97.79 113.03,96.52 X9.A4
GPIO3
  Route2 0.406: 30.48,95.25 31.75,96.52 X6.C4 X10_AUX.C4 60.96,96.52 62.23,95.25 91.44,95.25 92.71,96.52 X7.C4 X9.C4
GPIO4
  Route2 0.406: X6.A6 30.48,91.44 31.75,92.71 60.96,92.71 62.23,91.44 X10_AUX.A6 X7.A6 91.44,91.44 92.71,92.71 111.76,92.71 113.03,91.44 X9.A6
GPIO5
  Route2 0.406: 30.48,90.17 31.75,91.44 X6.C6 58.29,91.31 X10_AUX.C6 58.55,91.31 60.96,91.31 62.23,90.04 91.44,90.17 92.71,91.44 X7.C6 X9.C6
  Route15 0.406: 93.98,91.31 X7.C6
GPIO6
  Route2 0.406: X6.A7 30.48,88.9 31.75,90.17 60.96,90.17 62.23,88.9 X10_AUX.A7 X7.A7 91.44,88.9 92.71,90.17 111.76,90.17 113.03,88.9 X9.A7
GPIO7
  Route2 0.406: 30.48,87.63 31.75,88.9 X6.C7 X10_AUX.C7 60.96,88.9 62.23,87.63 91.44,87.63 92.71,88.9 X7.C7 X9.C7
  Route15 0.406: 93.98,88.77 X7.C7
HV
  Route2 0.406: X7.C26 X7.A26 JP1.1 X10_AUX.A26 X10_AUX.C26 X6.C26 X6.A26
HV_INTERLOCK
  Bottom 0.406: X6.A24 X6.C24 X10_AUX.C24 X10_AUX.A24 X7.A24 X7.C24 X9.C24 X9.A24
I2C_SCL
  Bottom 0.406: X9.C12 X7.C12 92.71,76.2 91.44,74.93 62.23,74.93 60.96,76.2 X10_AUX.C12 X6.C12 31.75,76.2 30.48,74.93
I2C_SDA
  Bottom 0.406: X9.A12 113.03,76.2 111.76,77.47 92.71,77.47 91.44,76.2 X7.A12 X10_AUX.A12 62.23,76.2 60.96,77.47 31.75,77.47 30.48,76.2 X6.A12
N$1
  Bottom 0.406: 128.02,69.88 U1.1 | 127.96,67.04 L1.P$2 | C4.P$2 125.35,67.18 126.37,68.2 126.37,69.83 U1.2
  Bottom 0.61: L1.P$2 128.02,69.88 | U1.1 U1.2
N$5
  Bottom 0.406: U1.5 119.04,69.9 R4.P$2 118.63,69.49 R3.P$1
SPI_CS1
  Bottom 0.406: X9.C20 104.14,55.88 95.25,46.99 57.15,46.99 52.07,52.07 10.16,52.07
SPI_CS2
  Bottom 0.406: X9.C19 101.6,58.42 95.25,52.07 57.15,52.07 52.07,57.15 10.16,57.15
SPI_CS3
  Bottom 0.406: X9.C18 99.06,60.96 95.25,57.15 57.15,57.15 52.07,62.23 10.16,62.23
SPI_CS4
  Bottom 0.406: X9.A18 113.03,60.96 111.76,62.23 97.79,62.23 95.25,59.69 57.15,59.69 52.07,64.77 10.16,64.77
SPI_CS5
  Bottom 0.406: X9.C17 96.52,63.5 95.25,62.23 57.15,62.23 52.07,67.31 10.16,67.31
SPI_CS6
  Bottom 0.406: X9.A17 113.03,63.5 111.76,64.77 57.15,64.77 53.34,68.58 X6.C15
SPI_CS7
  Bottom 0.406: X9.A16 113.03,66.04 111.76,67.31 106.68,67.31 105.41,68.58 X7.C15
SPI_CS8_AUX
  Bottom 0.406: X9.A20 113.03,55.88 111.76,57.15 102.87,57.15 95.25,49.53 57.15,49.53 52.07,54.61 10.16,54.61
SPI_CS9_AUX
  Bottom 0.406: X9.A19 113.03,58.42 111.76,59.69 100.33,59.69 95.25,54.61 57.15,54.61 52.07,59.69 10.16,59.69
SPI_CS10_AUX
  Bottom 0.406: X9.C16 105.41,66.04 104.14,67.31 62.23,67.31 60.96,68.58 X10_AUX.C15
SPI_MISO
  Bottom 0.406: 93.98,70.99 X7.C14 | 30.48,69.85 31.75,71.12 X6.C14 X10_AUX.C14 60.96,71.12 62.23,69.85 91.44,69.85 92.71,71.12 X7.C14 | X7.C14 X9.C14
SPI_MOSI
  Bottom 0.406: X9.A14 113.03,71.12 111.76,72.39 92.71,72.39 91.44,71.12 X7.A14 X10_AUX.A14 62.23,71.12 60.96,72.39 31.75,72.39 30.48,71.12 X6.A14
SPI_SCLK
  Bottom 0.406: X6.A13 30.48,73.66 31.75,74.93 60.96,74.93 62.23,73.66 X10_AUX.A13 X7.A13 91.44,73.66 92.71,74.93 111.76,74.93 113.03,73.66 X9.A13
VDD
  Bottom 0.406: X6.A15 30.48,68.58 31.75,69.85 60.96,69.85 62.23,68.58 X10_AUX.A15 X7.A15 91.44,68.58 92.71,69.85 111.76,69.85 113.03,68.58 X9.A15
  Bottom 0.61: U1.4 122.81,69.83 C1.P$2 122.54,67.31 122.05,67.31 121.98,67.25 | X9.A15 118.11,64.77 119.51,64.77 121.98,67.25 | R3.P$2 121.79,67.44 121.98,67.25
VREF
  Bottom 1.27: X7.C32 X9.C32 X9.A32
  Bottom 1.397: X7.C32 X7.A32 X10_AUX.A32 X10_AUX.C32 X6.C32 X6.A32
  pour Bottom: 7.62,20.32 116.84,20.32 116.84,29.21 7.62,29.21
VSS  (via drill 0.7)
  other vias: 119.38,50.8 125.22,45.97 120.65,57.15 124.46,63.5 118.11,60.96 120.65,46.99 102.87,49.53 100.33,73.66 82.55,72.39 69.85,72.39 76.2,72.39 53.34,73.66 38.1,73.66 44.45,73.66 22.86,72.39 116.84,82.55 116.84,72.39 125.73,54.61
  pour Route15 (isolate 0.356, no thermals): 10.16,85.22 129.41,85.22 129.54,44.45 10.16,44.45
  pour Bottom (isolate 0.305): 129.54,85.22 10.16,85.22 10.16,44.45 129.54,44.45

### Text on the board
tPlace: Eurocard Backplane | v2.0 | GND | GND | HV | HV | HV | HV! | -15V | +15V | MOD1 | MOD6 | MOD8_AUX | MOD10_AUX | MOD7
bPlace: Eurocard Backplane | v2.0 | GND | GND | HV | High Voltage! | -15V | +15V | MOD6 | MOD10_AUX | MOD7